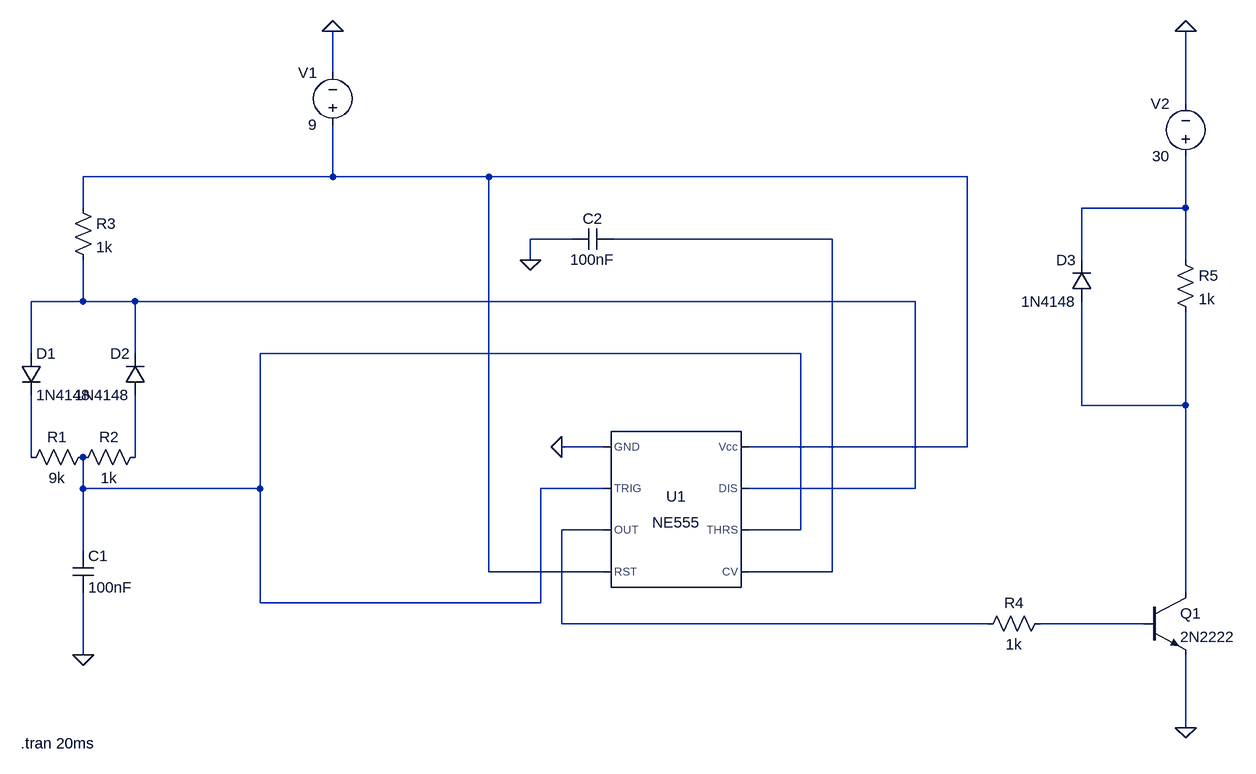
[diagram p0: schematic PWM_Rectifier.asc]
PWM_Rectifier.asc, the LTspice schematic file:
Version 4.1
SHEET 1 1368 680
WIRE -32 -432 -32 -496
WIRE 1280 -384 1280 -496
WIRE -32 -272 -32 -352
WIRE -32 -272 -416 -272
WIRE 208 -272 -32 -272
WIRE 944 -272 208 -272
WIRE -416 -224 -416 -272
WIRE 1280 -224 1280 -304
WIRE 1280 -224 1120 -224
WIRE 336 -176 272 -176
WIRE 736 -176 400 -176
WIRE 272 -144 272 -176
WIRE 1120 -144 1120 -224
WIRE 1280 -144 1280 -224
WIRE -416 -80 -416 -144
WIRE -416 -80 -496 -80
WIRE -336 -80 -416 -80
WIRE 864 -80 -336 -80
WIRE -496 0 -496 -80
WIRE -336 0 -336 -80
WIRE 688 0 -144 0
WIRE 1120 80 1120 -80
WIRE 1280 80 1280 -64
WIRE 1280 80 1120 80
WIRE 384 144 320 144
WIRE 944 144 944 -272
WIRE 944 144 608 144
WIRE -496 160 -496 64
WIRE -336 160 -336 64
WIRE -416 208 -416 160
WIRE -144 208 -144 0
WIRE -144 208 -416 208
WIRE 384 208 288 208
WIRE 864 208 864 -80
WIRE 864 208 608 208
WIRE 384 272 320 272
WIRE 688 272 688 0
WIRE 688 272 608 272
WIRE -416 304 -416 208
WIRE 208 336 208 -272
WIRE 384 336 208 336
WIRE 736 336 736 -176
WIRE 736 336 608 336
WIRE 1280 368 1280 80
WIRE -144 384 -144 208
WIRE 288 384 288 208
WIRE 288 384 -144 384
WIRE 320 416 320 272
WIRE 976 416 320 416
WIRE 1216 416 1056 416
WIRE -416 464 -416 368
WIRE 1280 576 1280 464
FLAG -416 464 0
FLAG 272 -144 0
FLAG 1280 576 0
FLAG 320 144 0
FLAG 1280 -496 0
FLAG -32 -496 0
SYMBOL Misc\\NE555 496 240 R0
SYMATTR InstName U1
SYMBOL cap -432 304 R0
SYMATTR InstName C1
SYMATTR Value 100nF
SYMBOL res -400 144 R90
WINDOW 0 0 56 VBottom 2
WINDOW 3 32 56 VTop 2
SYMATTR InstName R1
SYMATTR Value 9k
SYMBOL res -320 144 R90
WINDOW 0 0 56 VBottom 2
WINDOW 3 32 56 VTop 2
SYMATTR InstName R2
SYMATTR Value 1k
SYMBOL diode -512 0 R0
SYMATTR InstName D1
SYMATTR Value 1N4148
SYMBOL diode -320 64 R180
WINDOW 0 24 64 Left 2
WINDOW 3 24 0 Left 2
SYMATTR InstName D2
SYMATTR Value 1N4148
SYMBOL res -432 -240 R0
SYMATTR InstName R3
SYMATTR Value 1k
SYMBOL cap 400 -192 R90
WINDOW 0 0 32 VBottom 2
WINDOW 3 32 32 VTop 2
SYMATTR InstName C2
SYMATTR Value 100nF
SYMBOL res 1072 400 R90
WINDOW 0 0 56 VBottom 2
WINDOW 3 32 56 VTop 2
SYMATTR InstName R4
SYMATTR Value 1k
SYMBOL npn 1216 368 R0
SYMATTR InstName Q1
SYMATTR Value 2N2222
SYMBOL res 1264 -160 R0
SYMATTR InstName R5
SYMATTR Value 1k
SYMBOL diode 1136 -80 R180
WINDOW 0 24 64 Left 2
WINDOW 3 24 0 Left 2
SYMATTR InstName D3
SYMATTR Value 1N4148
SYMBOL voltage -32 -336 R180
WINDOW 0 24 96 Left 2
WINDOW 3 24 16 Left 2
WINDOW 123 0 0 Left 0
WINDOW 39 0 0 Left 0
SYMATTR InstName V1
SYMATTR Value 9
SYMBOL voltage 1280 -288 R180
WINDOW 0 24 96 Left 2
WINDOW 3 24 16 Left 2
WINDOW 123 0 0 Left 0
WINDOW 39 0 0 Left 0
SYMATTR InstName V2
SYMATTR Value 30
TEXT -512 600 Left 2 !.tran 20ms

The netlist it stands for:
* PWM_Rectifier.asc
X§U1 0 N005 N009 N001 N003 N005 N004 N001 NE555  ; pins GND TRIG OUT RST CV THRS DIS Vcc
C1 N005 0 100nF
R1 N005 N007 9k
R2 N008 N005 1k
D1 N004 N007 1N4148
D2 N008 N004 1N4148
R3 N001 N004 1k
C2 N003 0 100nF
R4 N010 N009 1k
Q1 N006 N010 0 0 2N2222
R5 N002 N006 1k
D3 N006 N002 1N4148
V1 N001 0 9
V2 N002 0 30
.model D D
.lib standard.dio
.model NPN NPN
.model PNP PNP
.lib standard.bjt
.tran 20ms
.lib NE555.sub
.backanno
.end